# EAGLE design WaterAlarmESP12-5 (EAGLE 6.4)
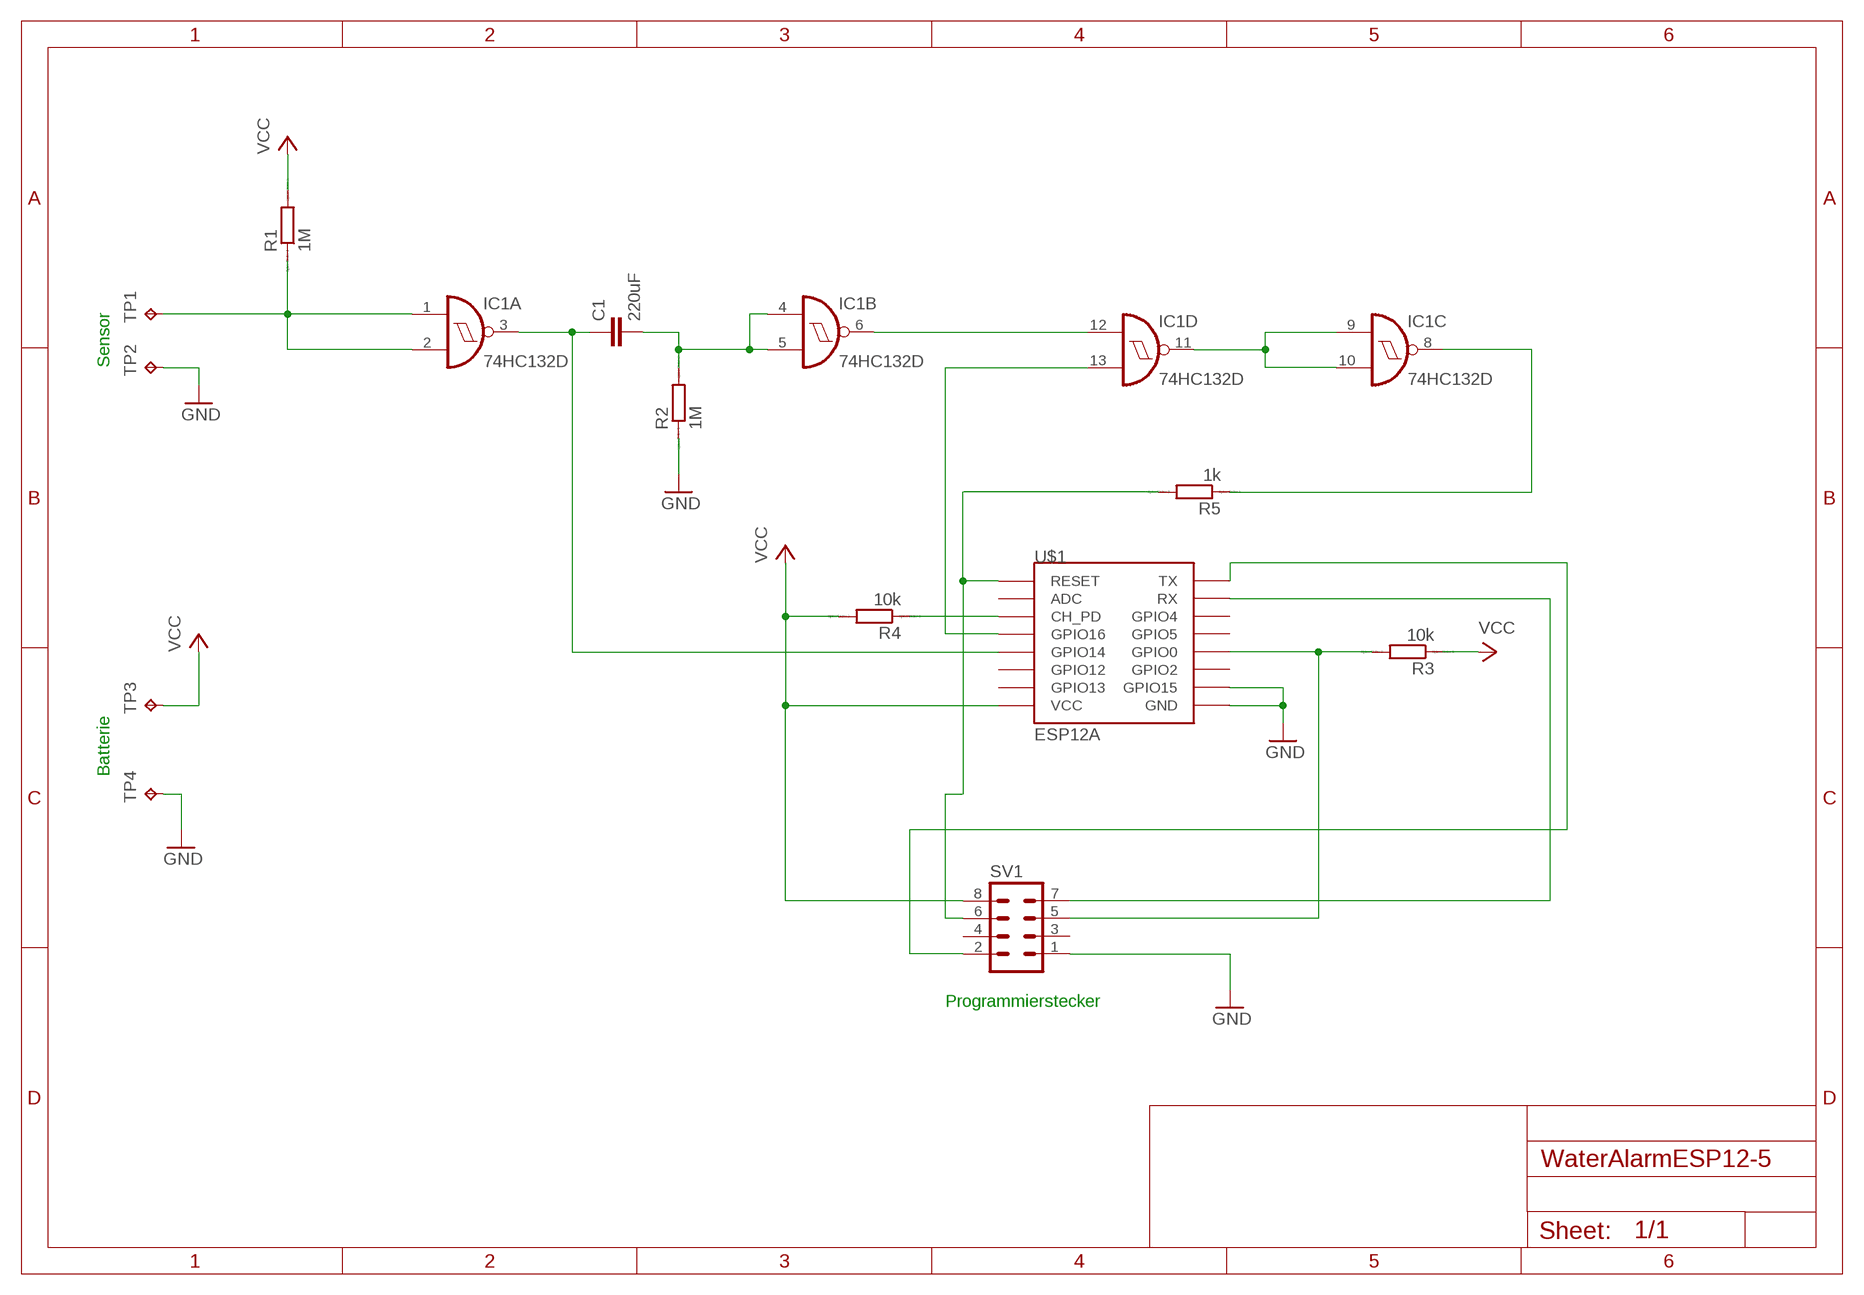
[diagram p0: schematic, sheet 1]

## Parts
C1  220uF  C-EUC1206  [C1206]
IC1  74HC132D  [SO14]
R1  1M  RR1206  [R1206]
R2  1M  RR1206  [R1206]
R3  10k  RR1206  [R1206]
R4  10k  RR1206  [R1206]
R5  1k  RR1206  [R1206]
SV1  MA04-2  [MA04-2]
TP1  TPPAD1-17  [P1-17]
TP2  TPPAD1-17  [P1-17]
TP3  TPPAD1-17  [P1-17]
TP4  TPPAD1-17  [P1-17]
U$1  ESP12A  [ESP12A]

## Nets
GND: R2.1 SV1.1 TP2.TP TP4.TP U$1.GND U$1.GPIO15
N$1: IC1.1(A:I0) IC1.2(A:I1) R1.1 TP1.TP
N$2: R4.1 U$1.CH_PD
N$3: C1.1 IC1.3(A:O) U$1.GPIO14
N$4: C1.2 IC1.4(B:I0) IC1.5(B:I1) R2.2
N$5: IC1.6(B:O) IC1.12(D:I0)
N$6: IC1.9(C:I0) IC1.10(C:I1) IC1.11(D:O)
N$7: R5.2 SV1.6 U$1.RESET
N$8: IC1.13(D:I1) U$1.GPIO16
N$9: R3.2 SV1.5 U$1.GPIO0
N$10: IC1.8(C:O) R5.1
N$11: SV1.2 U$1.TX
N$12: SV1.7 U$1.RX
VCC: R1.2 R3.1 R4.2 SV1.8 TP3.TP U$1.VCC
Unconnected: SV1.3 SV1.4 U$1.ADC U$1.GPIO2 U$1.GPIO4 U$1.GPIO5 U$1.GPIO12 U$1.GPIO13

## Notes on the sheet
- Sensor
- Batterie
- Programmierstecker

## Power pins joined to a net without a drawn wire
GND: IC1.7(P:GND)
VCC: IC1.14(P:VCC)

## Library data of the parts
C1 = rcl:C-EU: CAPACITOR, European symbol
IC1 = 74xx-eu:74*132: Quad 2-input NAND schmitt trigger
R1-R5 = eagle-ltspice:R: RESISTOR, European symbol; SPICEMODEL: NONE; SPICEPREFIX: R
SV1 = con-lstb:MA04-2: PIN HEADER; OC_FARNELL: unknown; OC_NEWARK: unknown
TP1-TP4 = testpad:TP: Test pad
U$1 = esp8266modulesx:ESP12A

## Net classes
0 default: clearance 0.355 mm

## Board
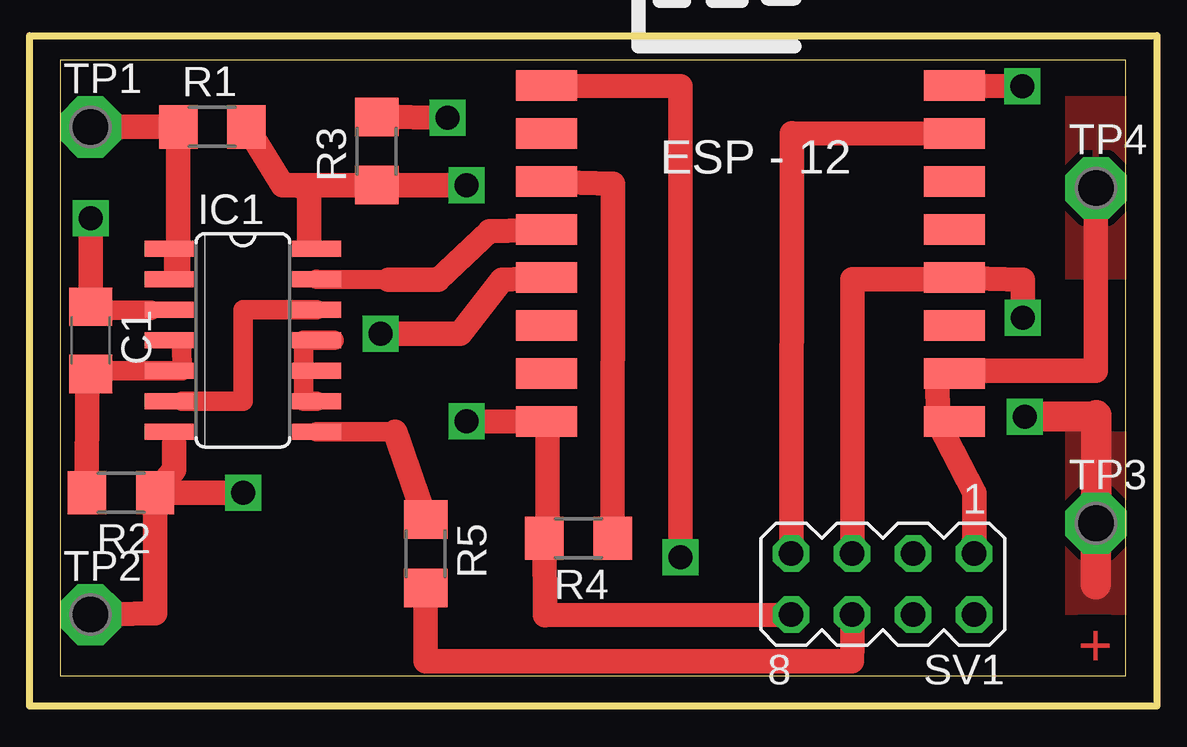
[diagram p1: board, top side]
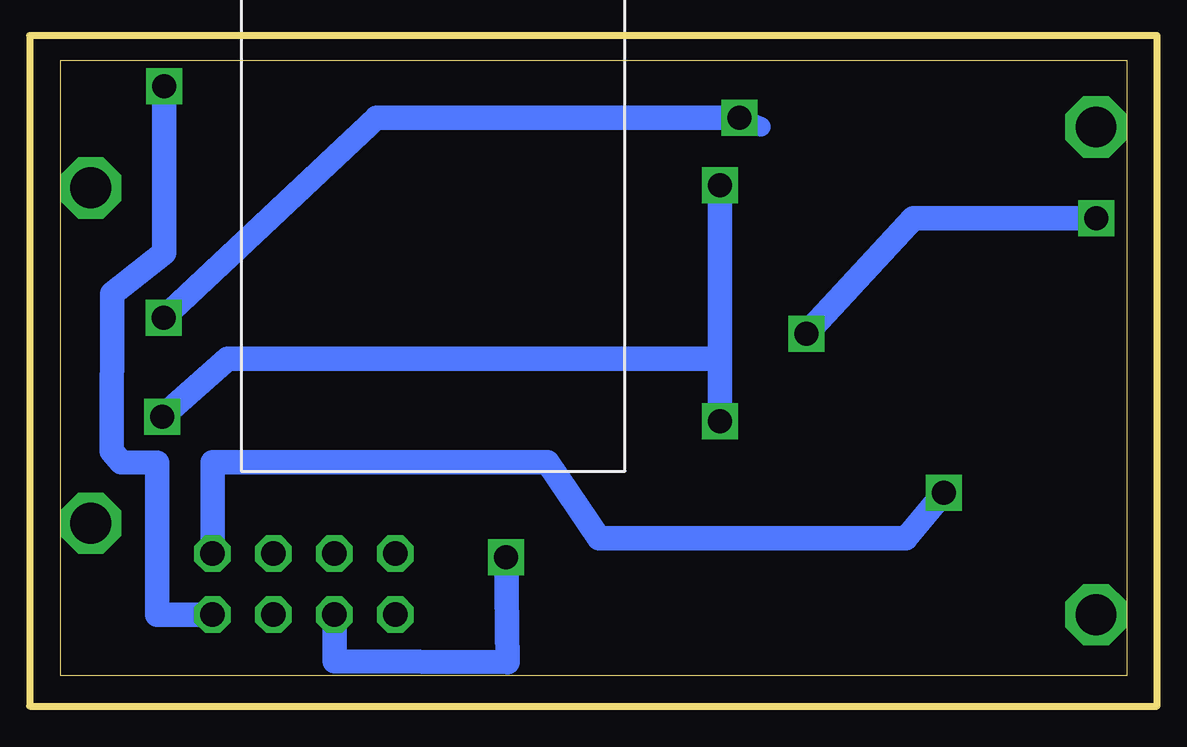
[diagram p2: board, bottom side, seen from below]

Size 44.43 x 25.65 mm. Coordinates in mm from the lower left corner, seen from the top.
Outline: 0,0 44.43,0 44.43,25.65 0,25.65 0,0
Copper layers (1*16): Top 0.035mm / dielectric 1.5mm / Bottom 0.035mm
Design rules "cnc *": minimum track width 20mil, minimum drill 24mil, track to track 12mil, track to pad 12mil, pad to pad 12mil, via to via 12mil, smd to smd 12mil, copper to edge 0mil, drill to drill 12mil, minimum pad ring 10mil, minimum via ring 8mil, stop-mask expansion 4mil, vias tented up to drill 0mil, thermal gap 12mil
Milling: 4 lines

### Footprints (pad centres in the part's own frame; a part is rotated, then mirrored left to right if it is on the bottom)
C1206 = smd 1.6 x 1.8: 1 -1.4,0; 2 1.4,0
SO14 = smd 0.66 x 2.032: 1 -3.81,-3.073; 2 -2.54,-3.073; 3 -1.27,-3.073; 4 0,-3.073; 5 1.27,-3.073; 6 2.54,-3.073; 7 3.81,-3.073; 8 3.81,3.073; 9 2.54,3.073; 10 1.27,3.073; 11 0,3.073; 12 -1.27,3.073; 13 -2.54,3.073; 14 -3.81,3.073
R1206 = smd 1.6 x 1.803: 1 -1.422,0; 2 1.422,0
MA04-2 = drill 1.016 octagon: 1 -3.81,-1.27; 2 -3.81,1.27; 3 -1.27,-1.27; 4 -1.27,1.27; 5 1.27,-1.27; 6 1.27,1.27; 7 3.81,-1.27; 8 3.81,1.27
P1-17 = drill 1.702 pad 2.54 octagon: TP 0,0
ESP12A = smd 2.54 x 1.27: ADC -10,3; CH_PD -10,1; GND 7,-9; GPIO0 7,-3; GPIO2 7,-5; GPIO4 7,1; GPIO5 7,-1; GPIO12 -10,-5; GPIO13 -10,-7; GPIO14 -10,-3; GPIO15 7,-7; GPIO16 -10,-1; RESET -10,5; RX 7,3; TX 7,5; VCC -10,-9

### Placement (x,y rotation side)
C1  1.27,13.97 270 top
IC1  7.62,13.97 270 top
R1  6.35,22.86 0 top
R2  2.54,7.62 180 top
R3  13.2,21.86 90 top
R4  21.61,5.72 180 top
R5  15.24,5.08 270 top
SV1  34.29,3.81 180 top
TP1  1.27,22.86 0 top
TP2  1.27,2.54 0 top
TP3  43.18,6.35 0 top
TP4  43.18,20.32 0 top
U$1  30.27,19.59 0 top

### Tracks (layer width: path | path; a pad name or v marks a point on that pad's centre or on a via)
GND  (via drill 1)
  Top 0.305: IC1.7 4.76,10.16 4.76,9.68
  Top 0.406: 36.54,12.58 36.83,12.58 | 36.83,12.58 38.1,12.58 38.1,12.7 | U$1.GPIO15 36.83,12.59 36.83,12.58 | 36.61,10.51 37.27,10.51 U$1.GND
  Top 1.016: 38.1,12.7 43.18,12.7 TP4.TP | SV1.1 38.1,7.62 36.61,10.51 36.54,12.58 | R2.1 3.97,2.59 TP2.TP | R2.1 4.76,8.58 4.76,9.68 | v7.62,7.62 R2.1
  Bottom 1.016: SV1.1 38.1,8.89 24.13,8.89 21.99,5.71 9.2,5.72 v7.62,7.62
  pour Top: 44.45,16.51 41.91,16.51 41.91,24.13 44.45,24.13
N$1
  Top 0.406: IC1.1 IC1.2 4.92,16.51 4.92,17.78
  Top 1.016: TP1.TP R1.1 4.92,17.78 4.92,16.69
N$2
  Top 1.016: U$1.CH_PD 23.05,20.5 R4.1
N$3  (via drill 1)
  Top 0.406: 3.79,15.23 IC1.3
  Top 0.813: C1.1 1.74,15.23 3.79,15.23
  Top 1.016: U$1.GPIO14 18.43,16.5 16.67,14.25 v13.35,14.23 | v1.27,19.05 C1.1
  Bottom 1.016: v13.35,14.23 8.89,19.05 v1.27,19.05
N$4
  Top 0.508: 1.62,12.7 C1.2 | IC1.4 4.62,13.9 4.72,13.9 5.07,13.78
  Top 0.813: 1.13,11.9 C1.2 | 1.27,12.7 1.62,12.7 IC1.5 4.62,12.7 5.08,12.7 5.07,13.78
  Top 1.016: R2.2 1.13,11.9
N$5
  Top 0.508: IC1.6 4.62,11.5 4.72,11.5 5.08,11.43
  Top 0.813: IC1.12 7.62,15.24 7.62,11.43 5.08,11.43
N$6
  Top 0.508: IC1.10 10.16,12.7
  Top 0.813: 11.43,13.97 IC1.11 10.16,13.97 10.16,12.7 10.16,11.43 IC1.9
N$7  (via drill 1)
  Top 1.016: SV1.6 33.02,1.27 33.01,0.6 15.24,0.6 R5.2 | U$1.RESET 25.86,24.55 v25.86,4.92
  Bottom 1.016: v25.86,4.92 25.81,0.55 33.01,0.6 SV1.6
N$8
  Top 0.813: 13.68,16.5 IC1.13
  Top 1.016: U$1.GPIO16 17.9,18.52 15.75,16.5 13.68,16.5
N$9  (via drill 1)
  Top 0.406: U$1.GPIO0 36.83,16.59 36.83,16.51
  Top 0.813: 34.29,16.51 U$1.GPIO0
  Top 1.016: SV1.5 33.02,16.51 36.83,16.51 | v40.14,14.91 40.14,16.5 U$1.GPIO0 | v16.15,23.25 R3.2
  Bottom 0.813: v16.15,23.25 15.24,22.86
  Bottom 1.016: v16.15,23.25 31.26,23.25 v40.14,14.91
N$10
  Top 0.813: 13.97,10.16 IC1.8
  Top 1.016: R5.1 13.97,10.16
N$11  (via drill 1)
  Top 1.016: v40.11,24.55 U$1.TX
  Bottom 1.016: SV1.2 40.41,2.54 40.41,8.88 41.91,8.89 42.31,9.34 42.27,15.91 40.11,17.61 v40.11,24.55
N$12
  Top 1.016: SV1.7 30.5,22.59 U$1.RX
VCC  (via drill 1)
  Top 0: 43.17,10.81 43.18,10.16
  Top 0.305: 9.28,20.43 10.04,20.43 10.04,20.37 | 10.38,18 10.69,18 IC1.14
  Top 0.813: R4.2 20.32,6.35
  Top 1.016: SV1.8 20.21,2.52 R4.2 | v16.95,20.43 R3.1 9.28,20.43 R1.2 | v16.94,10.61 U$1.VCC 20.32,10.59 20.32,6.35 | 10.04,20.37 10.39,20.2 10.38,18
  Top 1.27: v40.21,10.79 43.17,10.81 | TP3.TP 43.18,3.81 43.19,10.85
  Bottom 1.016: v40.21,10.79 37.47,13.21 17.98,13.21 16.95,13.2 | v16.94,10.61 16.95,13.2 | 16.95,13.2 v16.95,20.43
  pour Top: 44.45,10.16 41.91,10.16 41.91,2.54
  pour Top: 41.91,2.54 44.45,2.54 44.45,10.16 41.91,10.16

### Text on the board
Top: +